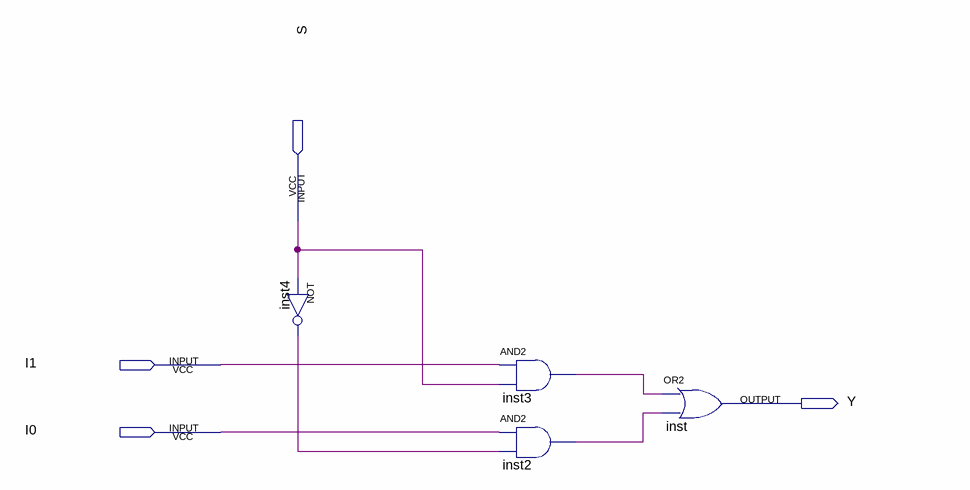
[diagram p0: schematic sheet]
// Quartus schematic Mux2_1.bdf as structural Verilog: 4 symbols, 4 pins
module Mux2_1 (
  input  S,
  input  I1,
  input  I0,
  output Y
);

  wire inst2_out, inst3_out, inst4_out;

  not inst4 (inst4_out, S);
  and inst3 (inst3_out, I1, S);
  and inst2 (inst2_out, I0, inst4_out);
  or inst (Y, inst3_out, inst2_out);
endmodule
